# EAGLE design WickedSwitch (EAGLE 7.7.0)
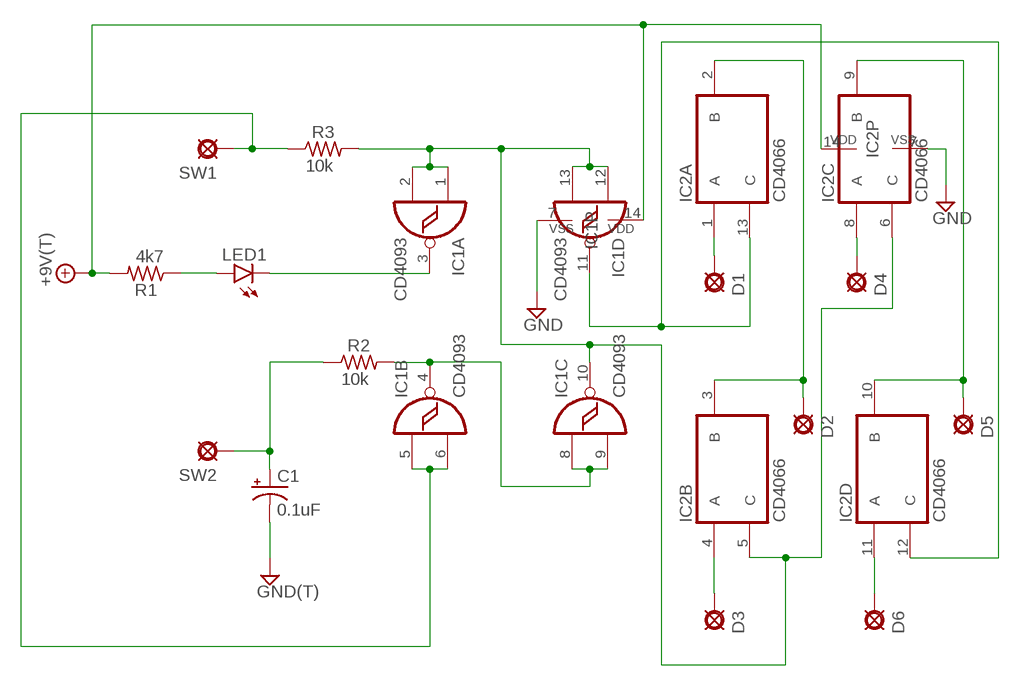
[diagram p0: schematic, sheet 1]

## Parts
+9V  +9V(T)  [SQUARE]
C1  0.1uF  0501  [050_020_1]
D1  1  PADO  [ROUND]
D2  1  PADO  [ROUND]
D3  1  PADO  [ROUND]
D4  1  PADO  [ROUND]
D5  1  PADO  [ROUND]
D6  1  PADO  [ROUND]
GND  GND(T)  [SQUARE]
IC1  CD4093  4093N  [DIL14]
IC2  CD4066  4066N  [DIL14]
LED1  LED3MM  [LED3MM]
R1  4k7  6MM.3  [R0207/3]
R2  10k  6MM.3  [R0207/3]
R3  10k  6MM.3  [R0207/3]
SW1  1  PADO  [ROUND]
SW2  1  PADO  [ROUND]

## Nets
+9V: +9V.1(+9V) IC1.14(P:VDD) IC2.14(P:VDD) R1.2
GND: C1.- GND.1(GND) IC1.7(P:VSS) IC2.7(P:VSS)
N$1: C1.+ R2.1 SW2.1(PAD)
N$2: D1.1(PAD) IC2.1(A:A)
N$3: LED1.A R1.1
N$4: IC1.3(A:O) LED1.K(C)
N$5: IC1.5(B:I0) IC1.6(B:I1) R3.1 SW1.1(PAD)
N$6: IC1.4(B:O) IC1.8(C:I0) IC1.9(C:I1) R2.2
N$7: D2.1(PAD) IC2.2(A:B) IC2.3(B:B)
N$8: IC1.11(D:O) IC2.12(D:C) IC2.13(A:C)
N$9: IC1.1(A:I0) IC1.2(A:I1) IC1.10(C:O) IC1.12(D:I0) IC1.13(D:I1) IC2.5(B:C) IC2.6(C:C) R3.2
N$10: D3.1(PAD) IC2.4(B:A)
N$11: D4.1(PAD) IC2.8(C:A)
N$13: D5.1(PAD) IC2.9(C:B) IC2.10(D:B)
N$14: D6.1(PAD) IC2.11(D:A)

## Library data of the parts
+9V = mb_supply:+9V(T): +9V Voltage Supply use this to hook up +9v throughout a schematic instead of running wire automatically labels the net "+9v" adds a hookup pad to the circuit board
C1 = mb_caps-electro:050: 0.22 - 100uF Xicon values at Mouser.com: 10V: 10 - 100uF; 16V: 2.2 - 47uF; 25V: 0.47 - 47uF; 50V: 0.22 - 22uF
D1-D6 SW1 SW2 = mb_supply:PAD: PAD use this package for pads with any purpose, including input, output, send or return various pad shapes: round, square, octogonal, long, and long offset
GND = mb_supply:GND(T): Ground use this to hook up ground (GND) throughout a schematic instead of running wire automatically labels the net "GND" adds a hookup pad to the circuit board (you can use several)
IC1 = 40xx:4093: Quad 2-input NAND schmitt trigger
IC2 = 40xx:4066: Quad bilateral ANALOG SWITCH
LED1 = mb_diodes:LED
R1-R3 = mb_resistors:6MM: 6mm Resistors Leads spaced 1-6 holes apart for 0.1" perfboard. Suitable for 1/4 watt resistors.

## Board
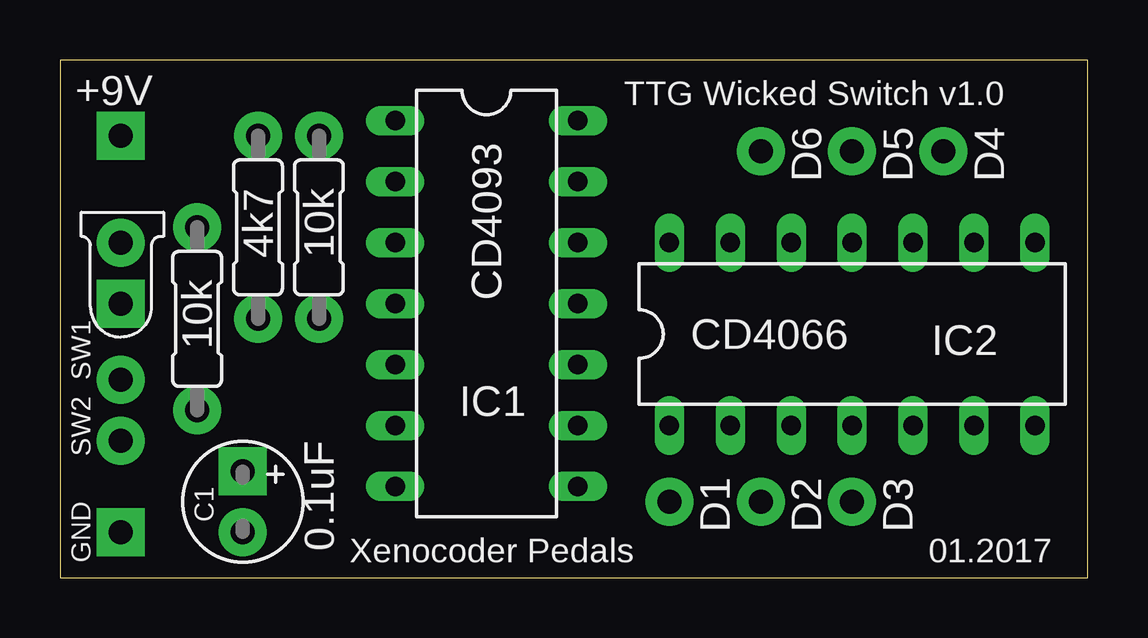
[diagram p1: board, top side]
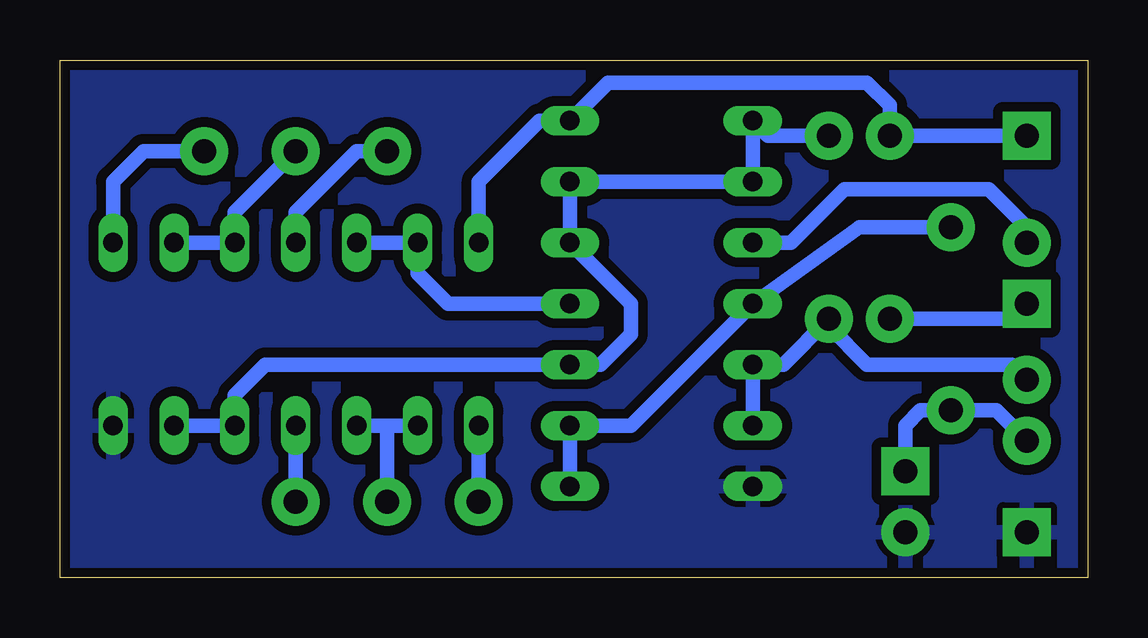
[diagram p2: board, bottom side, seen from below]

Size 42.85 x 21.58 mm. Coordinates in mm from the lower left corner, seen from the top.
Outline: 0,0 42.85,0 42.85,21.58 0,21.58 0,0
Copper layers (1*16): Top 0.0356mm / dielectric 1.5011mm / Bottom 0.0356mm
Design rules "LaenPCBOrder": minimum track width 6mil, minimum drill 13mil, track to track 6mil, track to pad 6mil, pad to pad 6mil, via to via 6mil, smd to smd 6mil, copper to edge 15mil, drill to drill 6mil, minimum pad ring 7mil, minimum via ring 7mil, stop-mask expansion 3mil, vias tented up to drill 0mil, thermal gap 10mil

### Footprints (pad centres in the part's own frame; a part is rotated, then mirrored left to right if it is on the bottom)
SQUARE = drill 1 pad 2 square: 1 0,0
050_020_1 = drill 1 pad 2 square: + -1.27,0 | drill 1 pad 2: - 1.27,0
ROUND = drill 1 pad 2: 1 0,0
DIL14 = drill 0.813 long: 1 -7.62,-3.81; 2 -5.08,-3.81; 3 -2.54,-3.81; 4 0,-3.81; 5 2.54,-3.81; 6 5.08,-3.81; 7 7.62,-3.81; 8 7.62,3.81; 9 5.08,3.81; 10 2.54,3.81; 11 0,3.81; 12 -2.54,3.81; 13 -5.08,3.81; 14 -7.62,3.81
LED3MM = drill 1 pad 2 square: A -1.27,0 | drill 1 pad 2: K 1.27,0
R0207/3 = drill 1 pad 2: 1 -3.81,0; 2 3.81,0

### Placement (x,y rotation side)
+9V  2.54,18.41 0 top
C1  7.62,3.17 270 top
D1  25.4,3.17 0 top
D2  29.21,3.17 0 top
D3  33.02,3.17 0 top
D4  36.83,17.78 0 top
D5  33.02,17.78 0 top
D6  29.21,17.78 0 top
GND  2.54,1.91 0 top
IC1  17.78,11.43 270 top
IC2  33.02,10.16 0 top
LED1  2.54,12.7 90 top
R1  8.26,14.61 90 top
R2  5.71,10.79 90 top
R3  10.79,14.61 90 top
SW1  2.54,8.26 0 top
SW2  2.54,5.71 0 top

### Tracks (layer width: path | path; a pad name or v marks a point on that pad's centre or on a via)
+9V
  Bottom 0.61: +9V.1 R1.2 8.26,19.68 9.21,20.64 20,20.64 IC1.14 22.86,19.05 25.4,16.51 IC2.14
GND
  pour Bottom (isolate 0.406): 0,21.59 43.18,21.59 43.18,0 0,0
N$1
  Bottom 0.61: SW2.1 3.81,6.99 R2.1 6.99,6.99 7.62,6.35 C1.+
N$2
  Bottom 0.61: IC2.1 D1.1
N$3
  Bottom 0.61: LED1.A 3.17,10.79 R1.1
N$4
  Bottom 0.61: IC1.3 12.38,13.97 10.16,16.19 4.13,16.19 2.54,14.61 LED1.K
N$5
  Bottom 0.61: SW1.1 3.17,8.89 9.21,8.89 10.79,10.48 R3.1 12.7,8.89 IC1.5 IC1.6
N$6
  Bottom 0.61: IC1.8 IC1.9 19.05,6.35 IC1.4 9.53,14.61 R2.2
N$7
  Bottom 0.61: IC2.2 29.21,6.35 | 29.21,6.35 IC2.3 | D2.1 29.21,6.35
N$8
  Bottom 0.61: IC1.11 26.67,11.43 27.94,12.7 IC2.13 IC2.12
N$9
  Bottom 0.61: R3.2 13.34,18.41 IC1.1 IC1.2 IC1.13 IC1.12 19.05,11.43 19.05,10.16 20.32,8.89 IC1.10 34.29,8.89 35.56,7.62 IC2.5 IC2.6
N$10
  Bottom 0.61: D3.1 IC2.4
N$11
  Bottom 0.61: D4.1 39.37,17.78 40.64,16.51 IC2.8
N$13
  Bottom 0.61: IC2.9 IC2.10 35.56,15.24 D5.1
N$14
  Bottom 0.61: D6.1 30.48,17.78 33.02,15.24 IC2.11

### Text on the board
tNames: TTG Wicked Switch v1.0 | Xenocoder Pedals | 01.2017